# EAGLE design Keyboard (EAGLE 7.2.0)
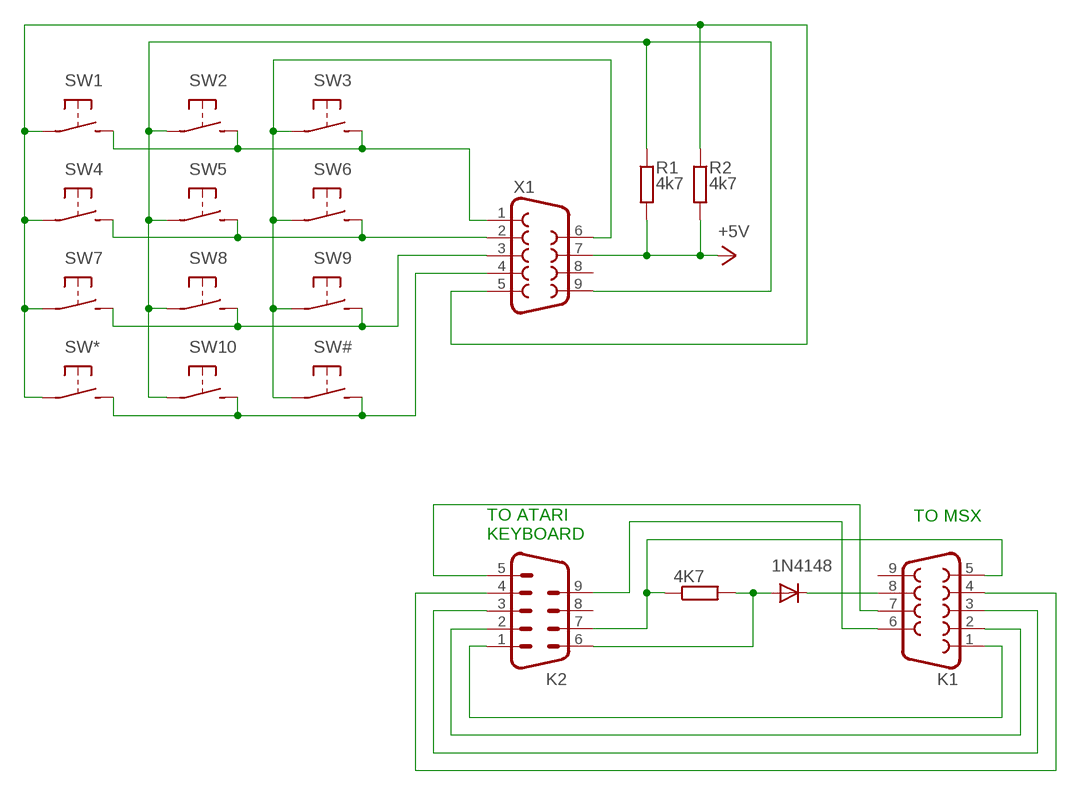
[diagram p0: schematic, sheet 1]

## Parts
1N4148  DIODE-D-5  [D-5]
4K7  R-EU_0204/5  [0204/5]
K1  F09D  [F09D]
K2  M09D  [M09D]
R1  4k7  R-EU_0204/7  [0204/7]
R2  4k7  R-EU_0204/7  [0204/7]
SW1  MINISPDT  [2PST_MINI]
SW2  MINISPDT  [2PST_MINI]
SW3  MINISPDT  [2PST_MINI]
SW4  MINISPDT  [2PST_MINI]
SW5  MINISPDT  [2PST_MINI]
SW6  MINISPDT  [2PST_MINI]
SW7  MINISPDT  [2PST_MINI]
SW8  MINISPDT  [2PST_MINI]
SW9  MINISPDT  [2PST_MINI]
SW10  MINISPDT  [2PST_MINI]
SW#  MINISPDT  [2PST_MINI]
SW*  MINISPDT  [2PST_MINI]
X1  F09D  [F09D]

## Nets
+5V: R1.2 R2.2 X1.7
N$1: SW1.P$2(S) SW2.P$2(S) SW3.P$2(S) X1.1
N$2: SW4.P$2(S) SW5.P$2(S) SW6.P$2(S) X1.2
N$3: SW7.P$2(S) SW8.P$2(S) SW9.P$2(S) X1.3
N$4: SW10.P$2(S) SW#.P$2(S) SW*.P$2(S) X1.4
N$5: SW3.P$1(P) SW6.P$1(P) SW9.P$1(P) SW#.P$1(P) X1.6
N$6: R1.1 SW2.P$1(P) SW5.P$1(P) SW8.P$1(P) SW10.P$1(P) X1.9
N$7: R2.1 SW1.P$1(P) SW4.P$1(P) SW7.P$1(P) SW*.P$1(P) X1.5
N$8: 4K7.1 K1.5 K2.7
N$9: 1N4148.C K1.8
N$10: K1.6 K2.9
N$11: K1.7 K2.5
N$12: K1.1 K2.1
N$13: K1.2 K2.2
N$14: 1N4148.A 4K7.2 K2.6
N$15: K1.3 K2.3
N$16: K1.4 K2.4
Unconnected: K1.9 K2.8 X1.8

## Notes on the sheet
- TO MSX
- TO ATARI 
  KEYBOARD

## Library data of the parts
1N4148 = diode:DIODE-: DIODE
4K7 R1 R2 = rcl:R-EU_: RESISTOR, European symbol
K1 X1 = con-subd:F09: SUB-D; OC_FARNELL: unknown; OC_NEWARK: unknown
K2 = con-subd:M09: SUB-D; OC_FARNELL: unknown; OC_NEWARK: unknown
SW1-SW10 SW# SW* = tactile:MINISPDT

## Board
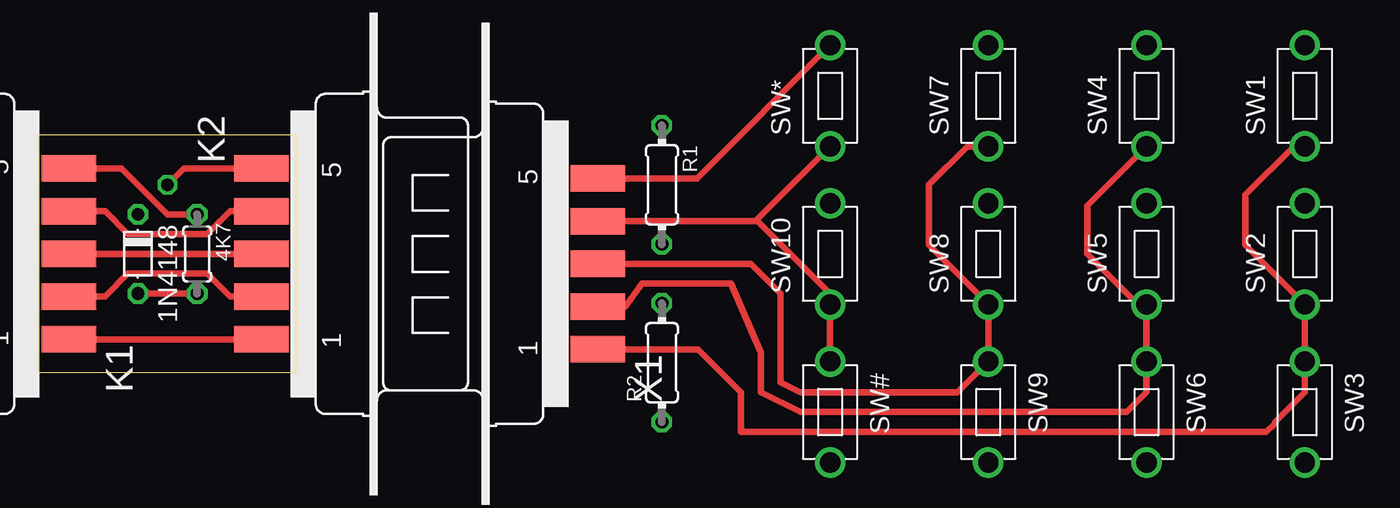
[diagram p1: board, top side]
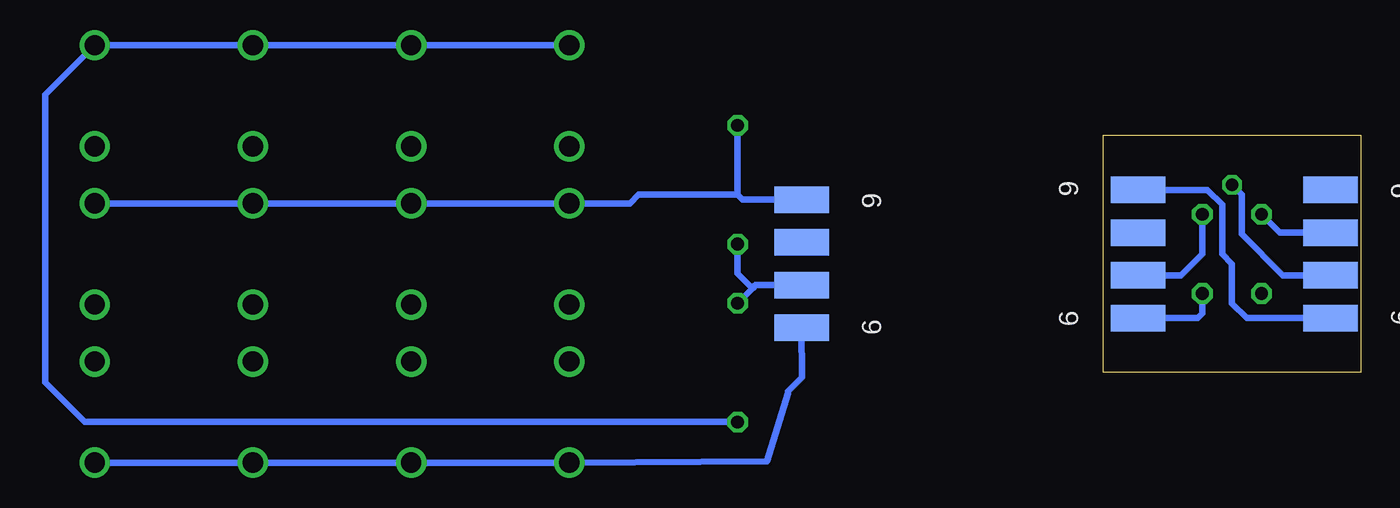
[diagram p2: board, bottom side, seen from below]

Size 16.51 x 15.24 mm. Coordinates in mm from the lower left corner, seen from the top.
Outline: 0,0 16.51,0 16.51,15.24 0,15.24 0,0
Copper layers (1*16): Top 0.035mm / dielectric 1.5mm / Bottom 0.035mm
Design rules "default": minimum track width 10mil, minimum drill 24mil, track to track 8mil, track to pad 8mil, pad to pad 8mil, via to via 8mil, smd to smd 8mil, copper to edge 40mil, drill to drill 8mil, minimum pad ring 10mil, minimum via ring 8mil, stop-mask expansion 4mil, vias tented up to drill 0mil, thermal gap 10mil

### Footprints (pad centres in the part's own frame; a part is rotated, then mirrored left to right if it is on the bottom)
D-5 = drill 0.813 octagon: A 2.54,0; C -2.54,0
0204/5 = drill 0.813 octagon: 1 -2.54,0; 2 2.54,0
F09D = smd 1.7 x 3.5: 1 -5.486,-6.045; 2 -2.743,-6.045; 3 0,-6.045; 4 2.743,-6.045; 5 5.486,-6.045 | smd 1.7 x 3.5 bottom: 6 -4.115,-6.045; 7 -1.372,-6.045; 8 1.372,-6.045; 9 4.115,-6.045
M09D = smd 1.7 x 3.5: 1 5.486,-6.045; 2 2.743,-6.045; 3 0,-6.045; 4 -2.743,-6.045; 5 -5.486,-6.045 | smd 1.7 x 3.5 bottom: 6 4.115,-6.045; 7 1.372,-6.045; 8 -1.372,-6.045; 9 -4.115,-6.045
0204/7 = drill 0.813 octagon: 1 -3.81,0; 2 3.81,0
2PST_MINI = drill 1.3: P$1 0,3.25; P$2 0,-3.25

### Placement (x,y rotation side)
1N4148  6.35,7.62 270 top
4K7  10.16,7.62 270 top
K1  -4.13,7.62 90 top
K2  20.32,7.62 270 top
R1  40.01,12.06 270 top  (outside the outline)
R2  40.01,0.63 90 top  (outside the outline)
SW1  81.28,17.78 0 top  (outside the outline)
SW2  81.28,7.62 0 top  (outside the outline)
SW3  81.28,-2.54 180 top  (outside the outline)
SW4  71.12,17.78 0 top  (outside the outline)
SW5  71.12,7.62 0 top  (outside the outline)
SW6  71.12,-2.54 180 top  (outside the outline)
SW7  60.96,17.78 0 top  (outside the outline)
SW8  60.96,7.62 0 top  (outside the outline)
SW9  60.96,-2.54 180 top  (outside the outline)
SW10  50.8,7.62 0 top  (outside the outline)
SW#  50.8,-2.54 180 top  (outside the outline)
SW*  50.8,17.78 0 top  (outside the outline)
X1  29.84,6.98 90 top  (outside the outline)

### Tracks (layer width: path | path; a pad name or v marks a point on that pad's centre or on a via)
+5V
  Bottom 0.406: X1.7 38.84,5.61 39.05,5.4 | 39.05,5.4 R2.2 | R1.2 40.01,6.35 39.05,5.4
N$1
  Top 0.406: SW1.P$2 80.57,14.53 77.47,11.43 77.47,8.18 SW2.P$2 SW3.P$2 81.28,-1.27 79.38,-3.18 79.38,-3.25 78.81,-3.81 45.09,-3.81 45.09,-1.27 42.32,1.5 X1.1
N$2
  Top 0.406: SW4.P$2 67.31,10.72 67.31,7.62 70.56,4.37 SW5.P$2 SW6.P$2 71.12,-1.27 69.85,-2.54 48.9,-2.54 46.35,-1.27 46.35,1.27 44.45,5.71 38.73,5.71 37.67,4.24 X1.2
N$3
  Top 0.406: SW7.P$2 59.62,14.53 57.15,12.06 57.15,8.18 SW8.P$2 SW9.P$2 58.98,-1.27 48.9,-1.27 47.62,-0.63 47.62,5.08 45.72,6.98 X1.3
N$4
  Top 0.406: X1.4 46,9.73 46.08,9.8 | SW*.P$2 46.08,9.8 | 46.08,9.8 50.8,5.08 SW10.P$2 SW#.P$2 50.8,0.56
N$5
  Bottom 0.406: X1.6 35.87,-0.3 36.76,-1.2 36.76,-1.34 38.1,-5.72 SW#.P$1 SW9.P$1 SW6.P$1 SW3.P$1
N$6
  Bottom 0.406: SW2.P$1 SW5.P$1 SW8.P$1 SW10.P$1 46.91,10.87 46.35,11.43 40.01,11.43 | X1.9 39.67,11.1 40.01,11.43 | R1.1 40.01,11.43
N$7
  Top 0.406: X1.5 42.24,12.47 SW*.P$1 | 81.36,20.95 SW1.P$1
  Bottom 0.406: SW*.P$1 SW7.P$1 SW4.P$1 SW1.P$1 84.45,17.85 84.45,-0.63 81.92,-3.18 R2.1
N$8
  Top 0.406: 4K7.1 8.26,10.16 5.31,13.11 K1.5
  Bottom 0.406: K2.7 11.53,6.25 10.16,7.62 4K7.1
N$9
  Bottom 0.406: K1.8 5.18,8.99 1N4148.C
N$10
  Bottom 0.406: K2.9 9.83,11.73 8.89,10.8 8.89,7.62 8.26,6.98 8.26,4.45 7.32,3.5 K1.6
N$11  (via drill 0.8 pad 1.27)
  Top 0.406: K2.5 9.3,13.11 v8.26,12.06
  Bottom 0.406: K1.7 4.98,6.25 7.62,8.89 7.62,11.43 v8.26,12.06
N$12
  Top 0.406: K1.1 K2.1
N$13
  Top 0.406: K1.2 4.24,4.88 5.71,6.35 10.79,6.35 12.27,4.88 K2.2
N$14
  Top 0.406: 1N4148.A 4K7.2
  Bottom 0.406: K2.6 10.46,3.5 10.16,3.81 4K7.2
N$15
  Top 0.406: K2.3 K1.3
N$16
  Top 0.406: K1.4 4.24,10.36 5.71,8.89 10.79,8.89 12.27,10.36 K2.4